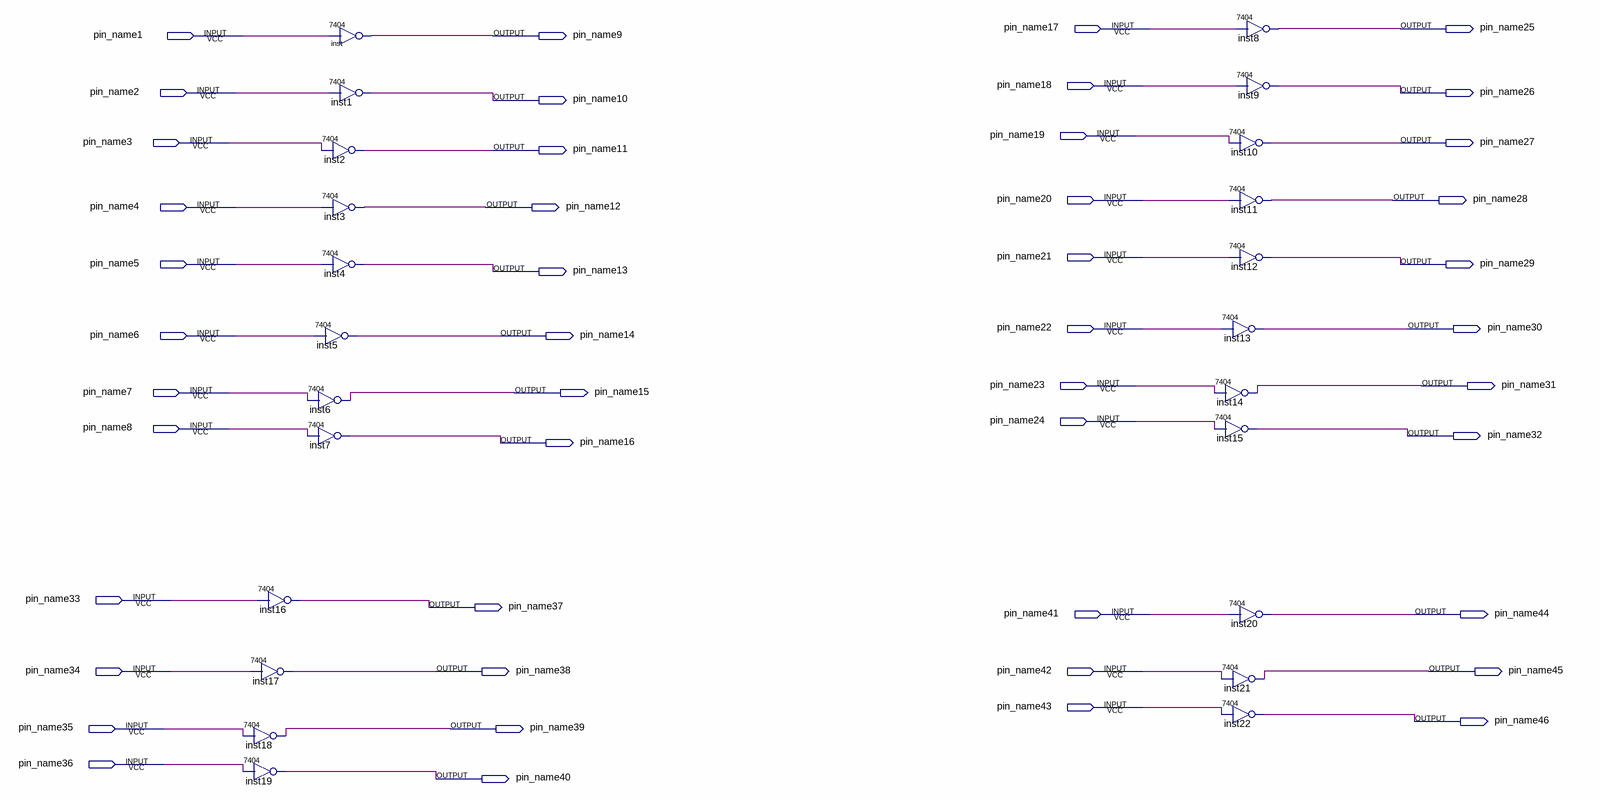
[diagram p0: schematic sheet]
// Quartus schematic TestButtonBoard.bdf as structural Verilog: 23 symbols, 46 pins
module TestButtonBoard (
  input  pin_name17,
  input  pin_name1,
  input  pin_name18,
  input  pin_name2,
  input  pin_name19,
  input  pin_name3,
  input  pin_name20,
  input  pin_name4,
  input  pin_name21,
  input  pin_name5,
  input  pin_name22,
  input  pin_name6,
  input  pin_name23,
  input  pin_name7,
  input  pin_name24,
  input  pin_name8,
  input  pin_name33,
  input  pin_name41,
  input  pin_name34,
  input  pin_name42,
  input  pin_name43,
  input  pin_name35,
  input  pin_name36,
  output pin_name25,
  output pin_name9,
  output pin_name26,
  output pin_name10,
  output pin_name27,
  output pin_name11,
  output pin_name28,
  output pin_name12,
  output pin_name29,
  output pin_name13,
  output pin_name30,
  output pin_name14,
  output pin_name31,
  output pin_name15,
  output pin_name32,
  output pin_name16,
  output pin_name37,
  output pin_name44,
  output pin_name38,
  output pin_name45,
  output pin_name46,
  output pin_name39,
  output pin_name40
);

  \7404  inst18 (.\2 (pin_name35), .\1 (pin_name39));
  \7404  inst19 (.\2 (pin_name36), .\1 (pin_name40));
  \7404  inst16 (.\2 (pin_name33), .\1 (pin_name37));
  \7404  inst17 (.\2 (pin_name34), .\1 (pin_name38));
  \7404  inst (.\2 (pin_name1), .\1 (pin_name9));
  \7404  inst1 (.\2 (pin_name2), .\1 (pin_name10));
  \7404  inst2 (.\2 (pin_name3), .\1 (pin_name11));
  \7404  inst3 (.\2 (pin_name4), .\1 (pin_name12));
  \7404  inst4 (.\2 (pin_name5), .\1 (pin_name13));
  \7404  inst5 (.\2 (pin_name6), .\1 (pin_name14));
  \7404  inst6 (.\2 (pin_name7), .\1 (pin_name15));
  \7404  inst7 (.\2 (pin_name8), .\1 (pin_name16));
  \7404  inst14 (.\2 (pin_name23), .\1 (pin_name31));
  \7404  inst15 (.\2 (pin_name24), .\1 (pin_name32));
  \7404  inst8 (.\2 (pin_name17), .\1 (pin_name25));
  \7404  inst9 (.\2 (pin_name18), .\1 (pin_name26));
  \7404  inst10 (.\2 (pin_name19), .\1 (pin_name27));
  \7404  inst11 (.\2 (pin_name20), .\1 (pin_name28));
  \7404  inst12 (.\2 (pin_name21), .\1 (pin_name29));
  \7404  inst13 (.\2 (pin_name22), .\1 (pin_name30));
  \7404  inst20 (.\2 (pin_name41), .\1 (pin_name44));
  \7404  inst21 (.\2 (pin_name42), .\1 (pin_name45));
  \7404  inst22 (.\2 (pin_name43), .\1 (pin_name46));
endmodule
